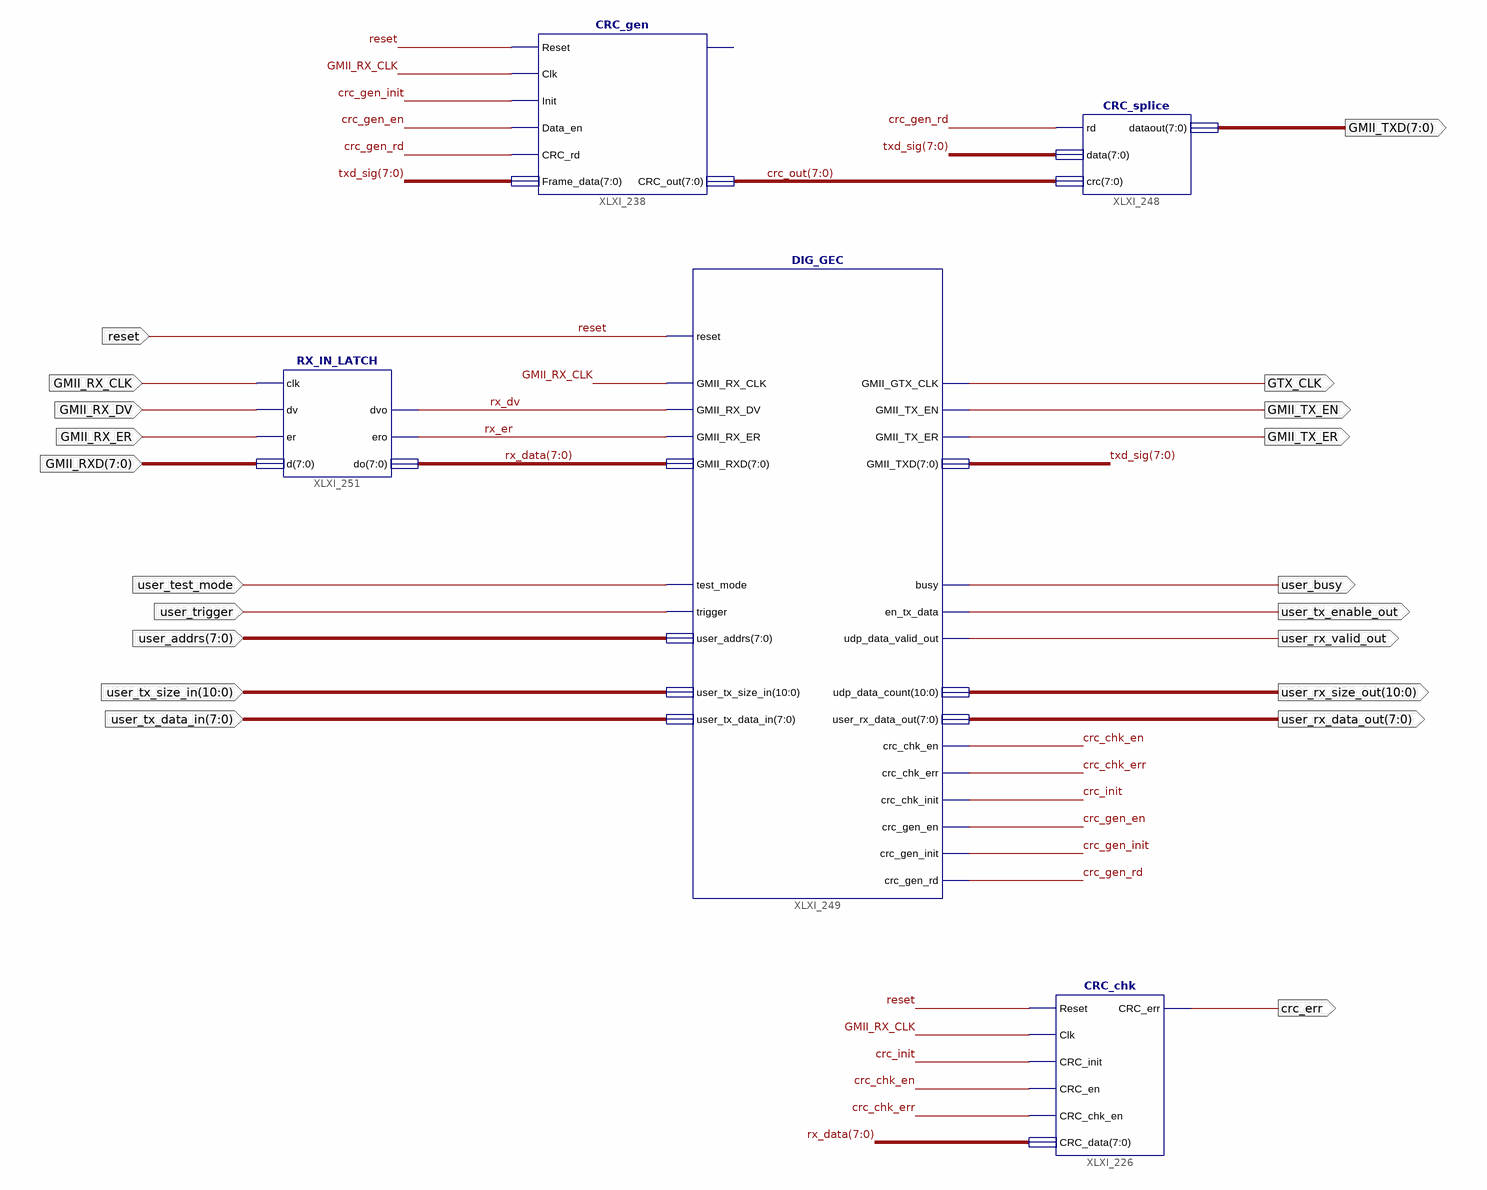
[diagram p0: schematic sheet 1]
// Xilinx ISE schematic gigabit_ethernet_controller.sch (virtex4) as structural Verilog: 5 symbols, 20 ports
module gigabit_ethernet_controller (
  input  [7:0] user_tx_data_in,
  input  [10:0] user_tx_size_in,
  input  [7:0] user_addrs,
  input  [7:0] GMII_RXD,
  input  GMII_RX_CLK,
  input  user_test_mode,
  input  user_trigger,
  input  reset,
  input  GMII_RX_DV,
  input  GMII_RX_ER,
  output [10:0] user_rx_size_out,
  output GMII_TX_EN,
  output GMII_TX_ER,
  output GTX_CLK,
  output user_busy,
  output user_rx_valid_out,
  output user_tx_enable_out,
  output [7:0] user_rx_data_out,
  output [7:0] GMII_TXD,
  output crc_err
);

  wire crc_chk_en, crc_chk_err, crc_gen_en, crc_gen_init, crc_gen_rd, crc_init, rx_dv, rx_er;
  wire [7:0] crc_out, rx_data, txd_sig;

  DIG_GEC XLXI_249 (
    .GMII_RX_CLK(GMII_RX_CLK), .GMII_RX_DV(rx_dv), .GMII_RX_ER(rx_er), .reset(reset),
    .test_mode(user_test_mode), .trigger(user_trigger), .GMII_RXD(rx_data), .user_addrs(user_addrs),
    .user_tx_data_in(user_tx_data_in), .user_tx_size_in(user_tx_size_in), .GMII_GTX_CLK(GTX_CLK),
    .GMII_TX_EN(GMII_TX_EN), .GMII_TX_ER(GMII_TX_ER), .busy(user_busy), .crc_chk_en(crc_chk_en),
    .crc_chk_err(crc_chk_err), .crc_chk_init(crc_init), .crc_gen_en(crc_gen_en), .crc_gen_init(crc_gen_init),
    .crc_gen_rd(crc_gen_rd), .en_tx_data(user_tx_enable_out), .udp_data_valid_out(user_rx_valid_out),
    .GMII_TXD(txd_sig), .udp_data_count(user_rx_size_out), .user_rx_data_out(user_rx_data_out));
  CRC_splice XLXI_248 (.rd(crc_gen_rd), .data(txd_sig), .crc(crc_out), .dataout(GMII_TXD));
  CRC_chk XLXI_226 (
    .Reset(reset), .Clk(GMII_RX_CLK), .CRC_init(crc_init), .CRC_en(crc_chk_en), .CRC_chk_en(crc_chk_err),
    .CRC_data(rx_data), .CRC_err(crc_err));
  CRC_gen XLXI_238 (
    .Reset(reset), .Clk(GMII_RX_CLK), .Init(crc_gen_init), .Data_en(crc_gen_en), .CRC_rd(crc_gen_rd),
    .Frame_data(txd_sig), .CRC_out(crc_out));  // open: CRC_end
  RX_IN_LATCH XLXI_251 (
    .clk(GMII_RX_CLK), .dv(GMII_RX_DV), .er(GMII_RX_ER), .d(GMII_RXD), .\do (rx_data), .dvo(rx_dv),
    .ero(rx_er));
endmodule
